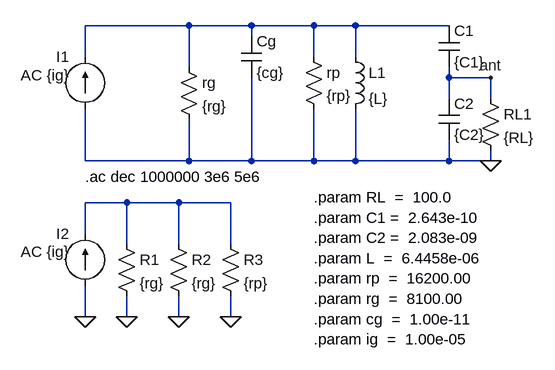
[diagram p0: schematic eje3.asc]
eje3.asc, the LTspice schematic file:
Version 4
SHEET 1 880 680
WIRE -288 -48 -448 -48
WIRE -192 -48 -288 -48
WIRE -96 -48 -192 -48
WIRE -32 -48 -96 -48
WIRE 112 -48 -32 -48
WIRE -192 -32 -192 -48
WIRE -448 0 -448 -48
WIRE -96 0 -96 -48
WIRE -32 0 -32 -48
WIRE -288 16 -288 -48
WIRE 112 32 112 16
WIRE 176 32 112 32
WIRE 112 64 112 32
WIRE 176 64 176 32
WIRE -448 160 -448 80
WIRE -288 160 -288 96
WIRE -288 160 -448 160
WIRE -192 160 -192 32
WIRE -192 160 -288 160
WIRE -96 160 -96 80
WIRE -96 160 -192 160
WIRE -32 160 -32 80
WIRE -32 160 -96 160
WIRE 112 160 112 128
WIRE 112 160 -32 160
WIRE 176 160 176 144
WIRE 176 160 112 160
WIRE -384 224 -448 224
WIRE -304 224 -384 224
WIRE -224 224 -304 224
WIRE -448 272 -448 224
WIRE -384 288 -384 224
WIRE -304 288 -304 224
WIRE -224 288 -224 224
WIRE -448 400 -448 352
WIRE -384 400 -384 368
WIRE -304 400 -304 368
WIRE -224 400 -224 368
FLAG 176 160 0
FLAG 176 32 ant
FLAG -304 400 0
FLAG -384 400 0
FLAG -448 400 0
FLAG -224 400 0
SYMBOL res 160 48 R0
SYMATTR InstName RL1
SYMATTR Value {RL}
SYMBOL cap -208 -32 R0
SYMATTR InstName Cg
SYMATTR Value {cg}
SYMATTR SpiceLine Rser=0
SYMBOL ind -48 -16 R0
SYMATTR InstName L1
SYMATTR Value {L}
SYMATTR SpiceLine Rser=0
SYMBOL res -304 0 R0
SYMATTR InstName rg
SYMATTR Value {rg}
SYMBOL current -448 80 R180
WINDOW 0 24 80 Left 2
WINDOW 3 24 0 Left 2
WINDOW 123 24 52 Left 2
WINDOW 39 0 0 Left 2
SYMATTR InstName I1
SYMATTR Value ""
SYMATTR Value2 AC {ig}
SYMBOL cap 96 -48 R0
SYMATTR InstName C1
SYMATTR Value {C1}
SYMATTR SpiceLine Rser=0
SYMBOL cap 96 64 R0
SYMATTR InstName C2
SYMATTR Value {C2}
SYMATTR SpiceLine Rser=0
SYMBOL res -112 -16 R0
SYMATTR InstName rp
SYMATTR Value {rp}
SYMBOL current -448 352 R180
WINDOW 0 24 80 Left 2
WINDOW 3 24 0 Left 2
WINDOW 123 24 52 Left 2
WINDOW 39 0 0 Left 2
SYMATTR InstName I2
SYMATTR Value ""
SYMATTR Value2 AC {ig}
SYMBOL res -400 272 R0
SYMATTR InstName R1
SYMATTR Value {rg}
SYMBOL res -320 272 R0
SYMATTR InstName R2
SYMATTR Value {rg}
SYMBOL res -240 272 R0
SYMATTR InstName R3
SYMATTR Value {rp}
TEXT -448 184 Left 2 !.ac dec 1000000 3e6 5e6
TEXT -96 216 Left 2 !.param RL  =  100.0 \n.param C1 =  2.643e-10 \n.param C2 =  2.083e-09 \n.param L  =  6.4458e-06 \n.param rp  =  16200.00 \n.param rg  =  8100.00 \n.param cg  =  1.00e-11 \n.param ig  =  1.00e-05

The netlist it stands for:
* eje3.asc
RL1 ant 0 {RL}
Cg N001 0 {cg} Rser=0
L1 N001 0 {L} Rser=0
rg N001 0 {rg}
I1 0 N001 AC {ig}
C1 N001 ant {C1} Rser=0
C2 ant 0 {C2} Rser=0
rp N001 0 {rp}
I2 0 N002 AC {ig}
R1 N002 0 {rg}
R2 N002 0 {rg}
R3 N002 0 {rp}
.ac dec 1000000 3e6 5e6
.param RL  =  100.0
.param C1 =  2.643e-10
.param C2 =  2.083e-09
.param L  =  6.4458e-06
.param rp  =  16200.00
.param rg  =  8100.00
.param cg  =  1.00e-11
.param ig  =  1.00e-05
.backanno
.end